# Altium schematic sheet FootBoard.SchDoc
size B; SheetNumber: 1; SheetTotal: 1
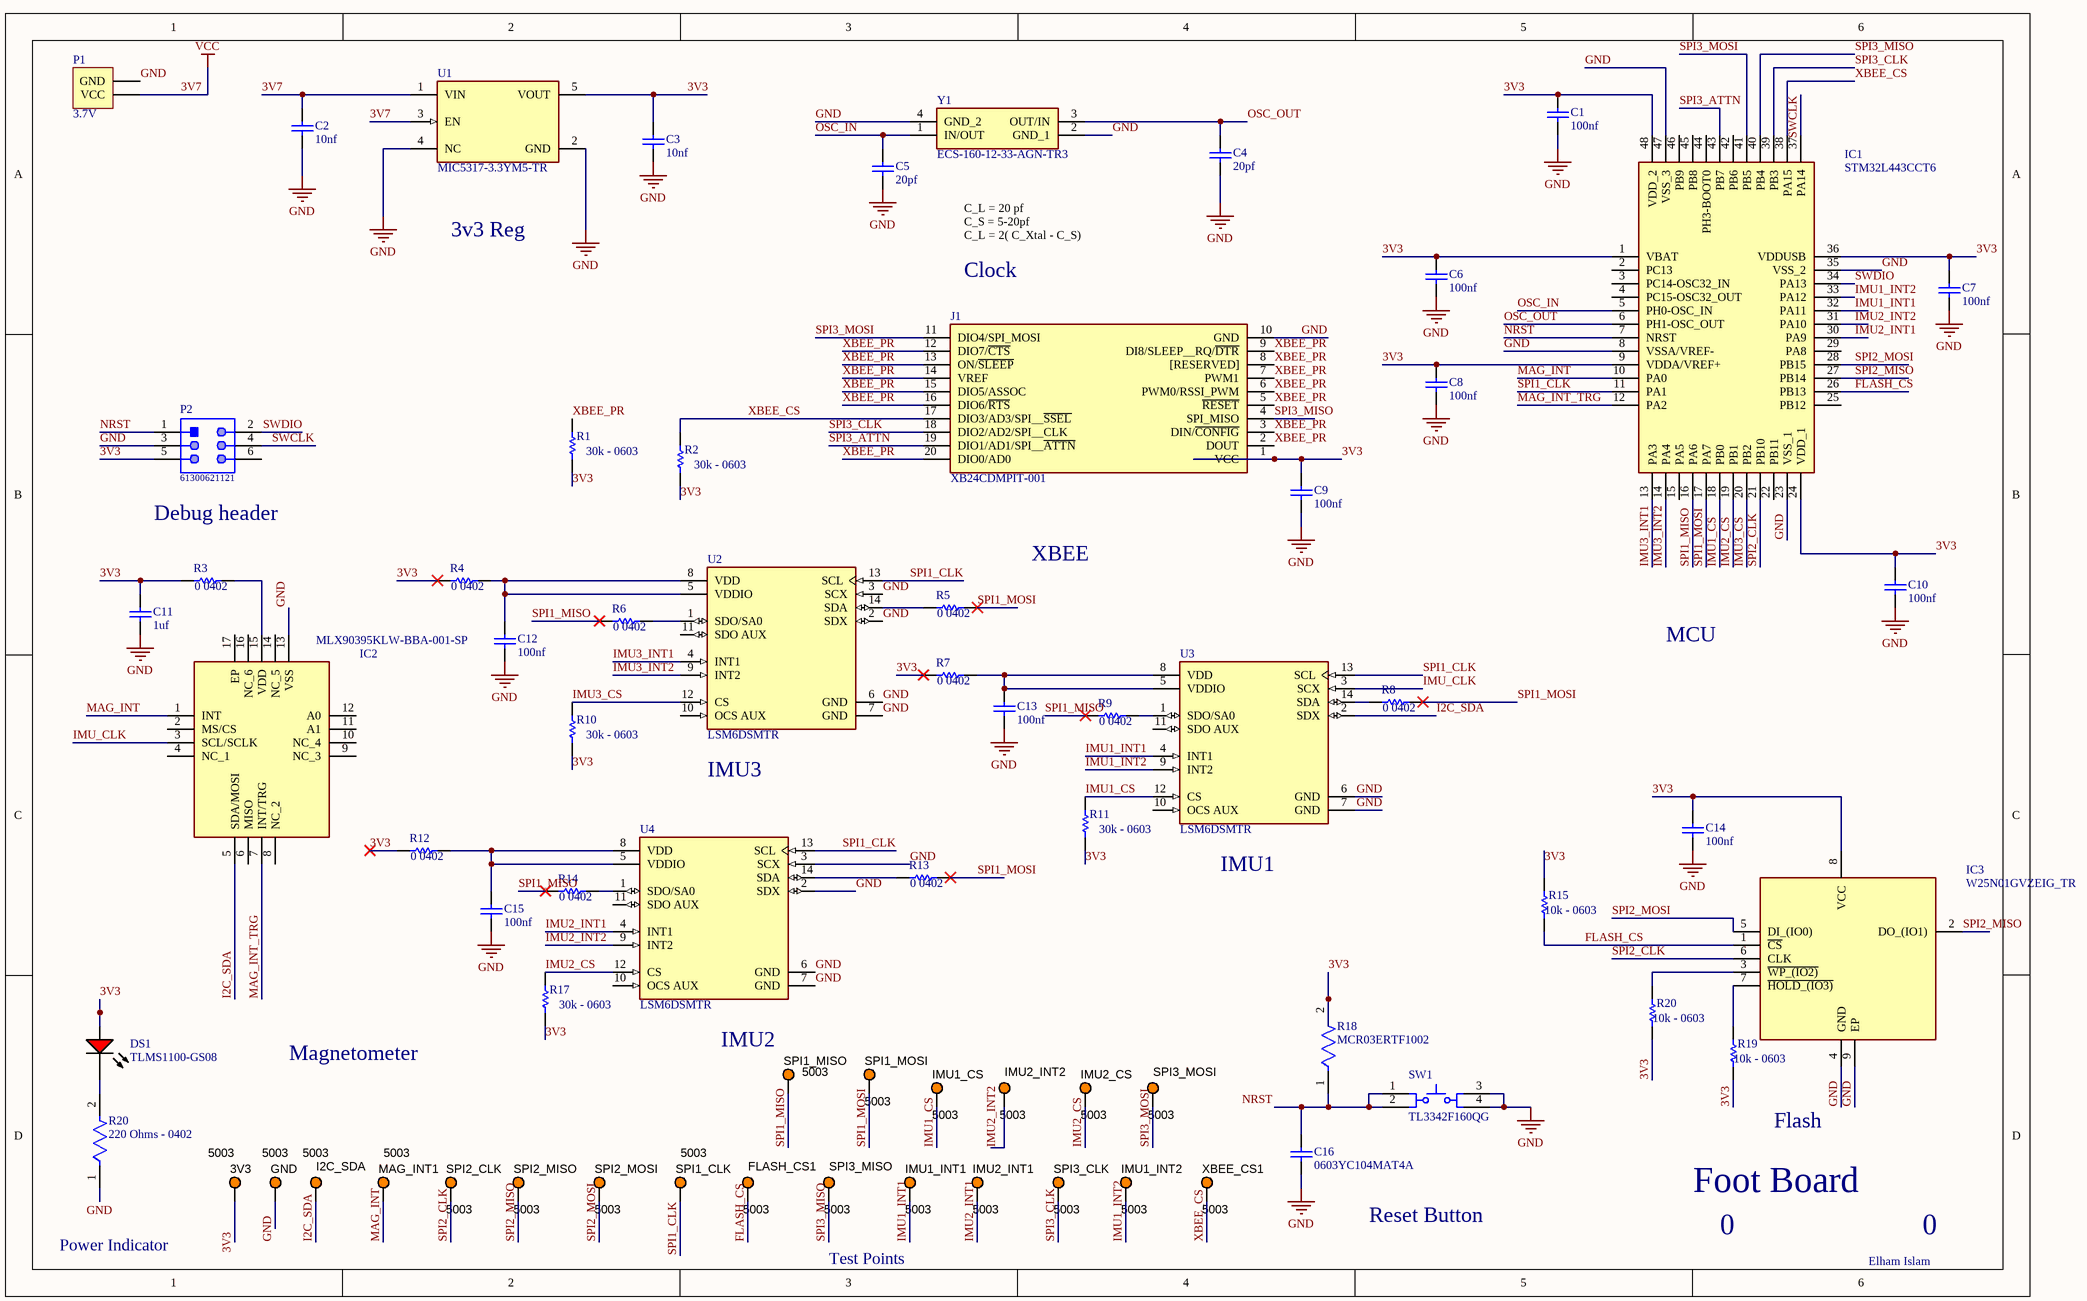
[diagram p0: FootBoard.SchDoc]

## Parts
(Parts that share a designator on the sheet are numbered #1, #2 ... from top to bottom, then left to right.)
3V3  5003  [KSTN-5003]
C1  100nf  [CAPC1608X90X35ML15T15]
C2  10nf  [CAPC1608X90X35ML15T15]
C3  10nf  [CAPC1608X90X35ML15T15]
C4  20pf  [CAPC2013X140X50NL20T25]
C5  20pf  [CAPC2013X140X50NL20T25]
C6  100nf  [CAPC1608X90X35ML15T15]
C7  100nf  [CAPC1608X90X35ML15T15]
C8  100nf  [CAPC1608X90X35ML15T15]
C9  100nf  [CAPC1608X90X35ML15T15]
C10  100nf  [CAPC1608X90X35ML15T15]
C11  1uf  [CAPC1608X90X35ML15T15]
C12  100nf  [CAPC1608X90X35ML15T15]
C13  100nf  [CAPC1608X90X35ML15T15]
C14  100nf  [CAPC1608X90X35ML15T15]
C15  100nf  [CAPC1608X90X35ML15T15]
C16  0603YC104MAT4A  [CAPC1608X90X35LL15T15]
DS1  TLMS1100-GS08  [VISH-TLMX1100_V]
FLASH_CS1  5003  [KSTN-5003]
GND  5003  [KSTN-5003]
I2C_SDA  5003  [KSTN-5003]
IC1  STM32L443CCT6  [QFP50P900X900X160-48N]
IC2  MLX90395KLW-BBA-001-SP  [QFN50P300X300X100-17N-D]
IC3  W25N01GVZEIG_TR  [SON127P800X600X80-9N-D]
IMU1_CS  5003  [KSTN-5003]
IMU1_INT1  5003  [KSTN-5003]
IMU1_INT2  5003  [KSTN-5003]
IMU2_CS  5003  [KSTN-5003]
IMU2_INT1  5003  [KSTN-5003]
IMU2_INT2  5003  [KSTN-5003]
J1  XB24CDMPIT-001  [XB24CDMPIT001]
MAG_INT1  5003  [KSTN-5003]
P1  3.7V  [HDR1X2]
P2  61300621121  [61300621121]
R1  30k - 0603  [RESC1609X55X30LL15T15]
R2  30k - 0603  [RESC1609X55X30LL15T15]
R3  0 0402  [RESC1005X40X25NL05T10]
R4  0 0402  [RESC1005X40X25NL05T10]
R5  0 0402  [RESC1005X40X25NL05T10]
R6  0 0402  [RESC1005X40X25NL05T10]
R7  0 0402  [RESC1005X40X25NL05T10]
R8  0 0402  [RESC1005X40X25NL05T10]
R9  0 0402  [RESC1005X40X25NL05T10]
R10  30k - 0603  [RESC1609X55X30LL15T15]
R11  30k - 0603  [RESC1609X55X30LL15T15]
R12  0 0402  [RESC1005X40X25NL05T10]
R13  0 0402  [RESC1005X40X25NL05T10]
R14  0 0402  [RESC1005X40X25NL05T10]
R15  10k - 0603  [RESC1609X55X30LL15T15]
R17  30k - 0603  [RESC1609X55X30LL15T15]
R18  MCR03ERTF1002  [FP-MCR03-IPC_C]
R19  10k - 0603  [RESC1609X55X30LL15T15]
R20#1  10k - 0603  [RESC1609X55X30LL15T15]
R20#2  220 Ohms - 0402  [FP-PNM0402-MFG]
SPI1_CLK  5003  [KSTN-5003]
SPI1_MISO  5003  [KSTN-5003]
SPI1_MOSI  5003  [KSTN-5003]
SPI2_CLK  5003  [KSTN-5003]
SPI2_MISO  5003  [KSTN-5003]
SPI2_MOSI  5003  [KSTN-5003]
SPI3_CLK  5003  [KSTN-5003]
SPI3_MISO  5003  [KSTN-5003]
SPI3_MOSI  5003  [KSTN-5003]
SW1  TL3342F160QG  [ESWI-TL3342F160QG_V]
U1  MIC5317-3.3YM5-TR  [FP-SOT23-5LD-PL-1-MFG]
U2  LSM6DSMTR  [FP-LGA-14L-DM00249496-MFG]
U3  LSM6DSMTR  [FP-LGA-14L-DM00249496-MFG]
U4  LSM6DSMTR  [FP-LGA-14L-DM00249496-MFG]
XBEE_CS1  5003  [KSTN-5003]
Y1  ECS-160-12-33-AGN-TR3  [ECS1601233AGNTR3]

## Nets
3V7: C2.2 P1.1(VCC) U1.1(VIN) U1.3(EN)  [also labelled VCC]
GND: C1.1 C2.1 C3.1 C4.1 C5.1 C6.1 C7.1 C8.1 C9.1 C10.1 C11.1 C12.1 C13.1 C14.1 C15.1 C16.1 GND.1 IC1.8(VSSA/VREF-) IC1.23(VSS_1) IC1.35(VSS_2) IC1.47(VSS_3) IC2.13(VSS) IC3.4(GND) IC3.9(EP) J1.10(GND) P1.2(GND) P2.3 R20#2.1 SW1.3 SW1.4 U1.2(GND) U1.4(NC) U2.2(SDX) U2.3(SCX) U2.6(GND) U2.7(GND) U3.6(GND) U3.7(GND) U4.2(SDX) U4.3(SCX) U4.6(GND) U4.7(GND) Y1.2(GND_1) Y1.4(GND_2)
3V3: 3V3.1 C1.2 C3.2 C6.2 C7.2 C8.2 C9.2 C10.2 C11.2 C14.2 DS1.1(A) IC1.1(VBAT) IC1.9(VDDA/VREF+) IC1.24(VDD_1) IC1.36(VDDUSB) IC1.48(VDD_2) IC3.8(VCC) J1.1(VCC) P2.5 R1.1 R2.1 R3.1 R4.1 R7.1 R10.1 R11.1 R12.1 R15.2 R17.1 R18.2 R19.1 R20#1.1 U1.5(VOUT)
FLASH_CS: FLASH_CS1.1 IC1.26(PB13) IC3.1(~{CS}) R15.1
I2C_SDA: I2C_SDA.1 IC2.5(SDA/MOSI) U3.2(SDX)
IMU1_CS: IC1.18(PB0) IMU1_CS.1 R11.2 U3.12(CS)
IMU1_INT1: IC1.32(PA11) IMU1_INT1.1 U3.4(INT1)
IMU1_INT2: IC1.33(PA12) IMU1_INT2.1 U3.9(INT2)
IMU2_CS: IC1.19(PB1) IMU2_CS.1 R17.2 U4.12(CS)
IMU2_INT1: IC1.30(PA9) IMU2_INT1.1 U4.4(INT1)
IMU2_INT2: IC1.31(PA10) IMU2_INT2.1 U4.9(INT2)
IMU3_CS: IC1.20(PB2) R10.2 U2.12(CS)
IMU3_INT1: IC1.13(PA3) U2.4(INT1)
IMU3_INT2: IC1.14(PA4) U2.9(INT2)
IMU_CLK: IC2.3(SCL/SCLK) U3.3(SCX)
MAG_INT: IC1.10(PA0) IC2.1(INT) MAG_INT1.1
MAG_INT_TRG: IC1.12(PA2) IC2.7(INT/TRG)
NRST: C16.2 IC1.7(NRST) P2.1 R18.1 SW1.1 SW1.2
OSC_IN: C5.2 IC1.5(PH0-OSC_IN) Y1.1(IN/OUT)
OSC_OUT: C4.2 IC1.6(PH1-OSC_OUT) Y1.3(OUT/IN)
SPI1_CLK: IC1.11(PA1) SPI1_CLK.1 U2.13(SCL) U3.13(SCL) U4.13(SCL)
SPI1_MISO: IC1.16(PA6) R6.1 R9.1 R14.1 SPI1_MISO.1
SPI1_MOSI: IC1.17(PA7) R5.2 R8.2 R13.2 SPI1_MOSI.1
SPI2_CLK: IC1.21(PB10) IC3.6(CLK) SPI2_CLK.1
SPI2_MISO: IC1.27(PB14) IC3.2(DO_(IO1)) SPI2_MISO.1
SPI2_MOSI: IC1.28(PB15) IC3.5(DI_(IO0)) SPI2_MOSI.1
SPI3_ATTN: IC1.43(PB7) J1.19(DIO1/AD1/SPI__~{ATTN})
SPI3_CLK: IC1.39(PB3) J1.18(DIO2/AD2/SPI__CLK) SPI3_CLK.1
SPI3_MISO: IC1.40(PB4) J1.4(SPI_MISO) SPI3_MISO.1
SPI3_MOSI: IC1.41(PB5) J1.11(DIO4/SPI_MOSI) SPI3_MOSI.1
SWCLK: IC1.37(PA14) P2.4
SWDIO: IC1.34(PA13) P2.2
XBEE_CS: IC1.38(PA15) J1.17(DIO3/AD3/SPI__~{SSEL}) R2.2 XBEE_CS1.1
XBEE_PR: J1.2(DOUT) J1.3(DIN/~{CONFIG}) J1.5(~{RESET}) J1.6(PWM0/RSSI_PWM) J1.7(PWM1) J1.8([RESERVED]) J1.9(DI8/SLEEP__RQ/~{DTR}) J1.12(DIO7/~{CTS}) J1.13(ON/~{SLEEP}) J1.14(VREF) J1.15(DIO5/ASSOC) J1.16(DIO6/~{RTS}) J1.20(DIO0/AD0) R1.2
NetC12_2: C12.2 R4.2 U2.5(VDDIO) U2.8(VDD)
NetC13_2: C13.2 R7.2 U3.5(VDDIO) U3.8(VDD)
NetC15_2: C15.2 R12.2 U4.5(VDDIO) U4.8(VDD)
NetDS1_2: DS1.2(K) R20#2.2
NetIC2_15: IC2.15(VDD) R3.2
NetIC3_3: IC3.3(~{WP_(IO2)}) R20#1.2
NetIC3_7: IC3.7(~{HOLD_(IO3)}) R19.2
NetR5_1: R5.1 U2.14(SDA)
NetR6_2: R6.2 U2.1(SDO/SA0)
NetR8_1: R8.1 U3.14(SDA)
NetR9_2: R9.2 U3.1(SDO/SA0)
NetR13_1: R13.1 U4.14(SDA)
NetR14_2: R14.2 U4.1(SDO/SA0)

Not connected (* = marked no-connect by the designer): IC1 2(PC13) 3(PC14-OSC32_IN) 4(PC15-OSC32_OUT) 15(PA5) 22(PB11) 25(PB12) 29(PA8) 42(PB6) 44(PH3-BOOT0) 45(PB8) 46(PB9); IC2 2(MS/CS) 4(NC_1) 6(MISO) 8(NC_2) 9(NC_3) 10(NC_4) 11(A1) 12(A0) 14(NC_5) 16(NC_6) 17(EP); P2 6; U2 10(OCS_AUX) 11(SDO_AUX); U3 10(OCS_AUX) 11(SDO_AUX); U4 10(OCS_AUX) 11(SDO_AUX)

## Notes on the sheet
- 3v3 Reg
- C_L = 20 pf
  C_S = 5-20pf
  C_L = 2( C_Xtal - C_S)
- Clock
- Debug header
- XBEE
- (near U2) Type @ to refer to a designator or a net
- MCU
- IMU3
- (near U4) Type @ to refer to a designator or a net
- (near U3) IMU1
- IMU2
- Magnetometer
- Flash
- Power Indicator
- Reset Button
- Foot Board
- 0
- Test Points
- Elham Islam

## Library data of the parts
3V3 FLASH_CS1 GND I2C_SDA IMU1_CS IMU1_INT1 IMU1_INT2 IMU2_CS IMU2_INT1 IMU2_INT2 MAG_INT1 SPI1_CLK SPI1_MISO SPI1_MOSI SPI2_CLK SPI2_MISO SPI2_MOSI SPI3_CLK SPI3_MISO SPI3_MOSI XBEE_CS1 = CMP-1672-00009-1: Test Point, Orange, 1-Pin THD, RoHS; Peak Reverse Current: 600 uA; Forward Current: 3 A; Max Surge Current: 80 A; Forward Voltage: 1.08 V; Max Operating Temperature: 150 degC; PackageReference: 5003; Pins: 2; ComponentLink2URL: http://keyelco.com/userAssets/file/M65p56.pdf; PackageDescription: 1-Pin Through Hole Device, Dia 2.54 mm; Weight: 0.01 lb; Diameter: 5.3 mm; Mount: Through Hole; Package Quantity: 500; Packaging: Bulk; Min Operating Temperature: -65 degC; ComponentLink1Description: Manufacturer URL; Height: 0.25 inch; ComponentLink1URL: http://www.keyelco.com/; ComponentLink2Description: Datasheet; Width: 0.25 inch; REACH SVHC: No SVHC; RoHSCompliant: true; Radiation Hardening: No; Length: 9.5 mm; DatasheetVersion: Jun-15
C1-C3 C6-C15 = CMP-2006-04543-1: Part Number: 0603YG105ZAT4A; Manufacturer: AVX Interconnect / Elco
C4 C5 = CMP-2007-04537-1: Part Number: 08051A200JAT2A; Manufacturer: AVX Interconnect / Elco
C16 = CMP-2006-02126-1: Manufacturer: AVX Interconnect / Elco; Part Number: 0603YC104MAT4A
DS1 = CMP-1666-00027-1: LED, RED, 2.1 V, -40 to 100 degC, 2-Pin SMD (0603), RoHS, Tape and Reel; Type (Capacitors): C0G; Resistance: 100000000000 Ohm; Capacitance: 12 pF; Voltage Rating: 50 V; Tolerance: 5%; Min Operating Temperature: -55degC; REACH SVHC: No SVHC; ComponentLink2Description: Datasheet; ComponentLink1URL: http://www.vishay.com/; Width: 0.8 mm; Package Quantity: 4000; PackageReference: TLMX1100; ComponentLink2URL: http://www.vishay.com/docs/83173/tlmb1100.pdf; Case/Package: 0603; Case Code (Metric): 1608; Packaging: Tape and Reel; Pins: 2; ComponentLink1Description: Manufacturer URL; Max Operating Temperature: 125degC; Height: 0.8 mm; Length: 1.6 mm; Mount: Surface Mount; PackageDescription: 2-Pin Surface Mount Device, Body 1.6 x 0.8 mm; DatasheetVersion: Rev. 2.7, 03/2016; Case Code (Imperial): 0603; Voltage Rating (DC): 50 V; RoHSCompliant: True; Radiation Hardening: No
IC1 = STM32L443CCT6: Integrated Circuit; Manufacturer_Name: STMicroelectronics; Datasheet Link: https://componentsearchengine.com/Datasheets/2/STM32L443CCT6.pdf; Height: 1.6mm; Manufacturer_Part_Number: STM32L443CCT6; Mouser Part Number: 511-STM32L443CCT6; Mouser Price/Stock: https://www.mouser.co.uk/ProductDetail/STMicroelectronics/STM32L443CCT6?qs=dTJS0cRn7ohLPtZ3IeJ%2Fbg%3D%3D; Arrow Part Number: STM32L443CCT6; Arrow Price/Stock: https://www.arrow.com/en/products/stm32l443cct6/stmicroelectronics?region=nac
IC2 = MLX90395KLW-BBA-001-SP: Integrated Circuit; Manufacturer_Name: Melexis; Datasheet Link: https://www.mouser.de/datasheet/2/734/Melexis_MLX90395_Datasheet_Melexis3-1863596.pdf; Height: 1mm; Manufacturer_Part_Number: MLX90395KLW-BBA-001-SP; Mouser Part Number: 482-90395KLWBBA001SP; Mouser Price/Stock: https://www.mouser.co.uk/ProductDetail/Melexis/MLX90395KLW-BBA-001-SP?qs=7MVldsJ5Uawn%252BTu7jMWOxA%3D%3D
IC3 = W25N01GVZEIG_TR: Integrated Circuit; Manufacturer_Name: Winbond; Manufacturer_Part_Number: W25N01GVZEIG TR; Datasheet Link: https://www.winbond.com/resource-files/w25n01gv revg 032116.pdf; Height: 0.8mm; Mouser Part Number: 454-W25N01GVZEIGTR; Mouser Price/Stock: https://www.mouser.co.uk/ProductDetail/Winbond/W25N01GVZEIG-TR?qs=qSfuJ%252Bfl%2Fd6niBi0Qz1MPg%3D%3D; Arrow Part Number: W25N01GVZEIG TR; Arrow Price/Stock: https://www.arrow.com/en/products/w25n01gvzeigtr/winbond-electronics?region=nac
J1 = XB24CDMPIT-001: Connector; Manufacturer_Name: DIGI; Datasheet Link: https://www.digi.com/pdf/ds_s2c-xbeedigimesh-24.pdf; Height: 3.556mm; Manufacturer_Part_Number: XB24CDMPIT-001; Mouser Part Number: 888-XB24CDMPIT-001; Mouser Price/Stock: https://www.mouser.co.uk/ProductDetail/DIGI/XB24CDMPIT-001?qs=XmMZR4xR0DA19znDagFynA%3D%3D
P1 = Header 2: Header, 2-Pin; LatestRevisionDate: 17-Jul-2002; LatestRevisionNote: Re-released for DXP Platform.; Publisher: Altium Limited
P2 = CMP-1502-01072-1: THT Vertical Pin Header WR-PHD, Pitch 2.54 mm, Dual Row, 6 pins; Manufacturer: Wurth Elektronik; Contact Resistance: 20mOhm; Withstanding Voltage: 500VAC; Pin Number: 6; Gender: Male; Pitch: 2.54mm; Working Voltage: 250VAC; Rated Current: 3A; Packaging: Bag; Row Number: Dual; Manufacturer URL: http://www.we-online.de; Part Number: 61300621121; Operating Temperature: -40to105degC; Mounting Technology: THT; Package Reference: 61300621121; Datasheet URL: https://katalog.we-online.de/em/datasheet/6130xx21121.pdf; Orientation: Vertical; Publisher: WurthElektronik
R1 R2 R10 R11 R15 R17 R19 R20#1 = CMP-1012-00623-3: Chip Resistor, 10 KOhm, +/- 1%, 0.1 W, -55 to 155 degC, 0603 (1608 Metric), RoHS, Tape and Reel; Manufacturer: Panasonic; Voltage Rating: 75V; Case\/Package: 0603; Power Rating: 100mW; Resistance: 10KOhm; Temperature Coefficient: 100ppm\/degreesC; Number of Pins: 2; Package Reference: 603; Depth: 0.8mm; Mount: SurfaceMount; Package Description: 2-Pin Surface Mount Device, Body 1.6 x 0.85 mm; Datasheet Version: 02/2017; Length: 1.6mm; Lead Free: LeadFree; Height: 0.45mm; Number of Terminations: 2; Max Power Dissipation: 100mW; Min Operating Temperature: -55degC; Datasheet URL: https://industrial.panasonic.com/cdbs/www-data/pdf/RDA0000/AOA0000C304.pdf; Termination: SMD/SMT; Case Code (Metric): 1608; Case Code (Imperial): 0603; Tolerance: 1%; Max Operating Temperature: 155degC; RoHSCompliant: true; Voltage Rating (DC): 75V; Radiation Hardening: No; Packaging: TapeandReel; Composition: ThickFilm; Mounting Technology: SurfaceMount; Manufacturer URL: http://www.panasonic.com/; Width: 0.031inch; REACH SVHC: NoSVHC; Contact Plating: Tin; Military Standard: Not; Package Quantity: 1
R3-R9 R12-R14 = CMP-1011-00001-2: Manufacturer: Yageo / Phycomp; Part Number: RC0402JR-070RL
R18 = CMP-2000-06685-2: Thick Film Chip Resistor, 0603, 10kΩ, 1%, 100ppm/°C, 0.1W, 50V; Max Power Dissipation: 100mW; Resistance: 10kR; Case Code (Imperial): 0603; RoHS Compliant: Yes; Voltage Rating (DC): 50V; Series: MCR; Case Code (Metric): 1608; Temperature Coefficient: 100ppm/°C; Package Quantity: 1; Packaging: Tape and Reel; Lead Free: Lead Free; Min Operating Temperature: -55°C; Max Operating Temperature: 155°C; Height: 0.022inch; Length: 0.063inch; Width: 0.031inch; Tolerance: 1%; Case/Package: 0603; Resistor Type: Thick Film; Number of Terminations: 2
R20#2 = CMP-02407-011888-1: RES SMD 500 OHM 0.1% 1/20W 0402; Temperature Coefficient: 25ppm/°C; Max Power Dissipation: 50mW; Resistance: 500R; Width: 0.022inch; Length: 0.042inch; Tolerance: 0.1%; Lead Free: Lead Free; Height: 0.033inch; Case Code (Metric): 1005; Features: Moisture Resistant; Case Code (Imperial): 0402; Max Operating Temperature: 155°C; Case/Package: 0402; Min Operating Temperature: -55°C; Package Quantity: 1000; RoHS Compliant: Yes; Packaging: Tape and Reel; Resistor Type: Thin Film; Number of Terminations: 2
SW1 = CMP-1696-00003-1: Switch, Tactile, SPST-NO, 50 mA, 12 V, 4-Pin SMD, RoHS, Tape and Reel; Voltage Rating (DC): 50 V; Tolerance: 20%; Case\Package: Radial; Capacitance: 4.7 uF; Max Operating Temperature: 85 degC; REACH SVHC: No SVHC; Package Quantity: 200; Voltage Rating: 50 V; ComponentLink1Description: Manufacturer URL; ComponentLink2URL: http://spec_sheets.e-switch.com/specs/P010632.pdf; ComponentLink2Description: Datasheet; Height: 11 mm; Lead Pitch: 2 mm; RoHSCompliant: true; Radiation Hardening: No; Pins: 2; Length: 11 mm; DatasheetVersion: Rev. I, 12/2010; PackageReference: TL3342F160QG; ComponentLink1URL: http://www.e-switch.ch/en/; PackageDescription: 4-Pin Surface Mount Device, Body 5 x 5 mm, Pitch 6.3 mm; Mount: Through Hole; Diameter: 5 mm; Packaging: Bulk; Min Operating Temperature: -40 degC; Width: 0 inch
U1 = CMP-06324-000116-1: IC REG LINEAR 3.3V 150MA SOT23-5; Max Input Voltage: 6V; Number of Regulators: 1; Min Current Limit: 200mA; Dropout Voltage: 155mV; Min Input Voltage: 2.5V; Power Supply Rejection Ratio (PSRR): 70dB; Case/Package: SOT-23-5; Output Voltage: 3.3V; Series: -; Max Operating Temperature: 125°C; Package Quantity: 3000; Mount: Surface Mount; Packaging: Tape and Reel; RoHS Compliant: No; Output Current: 150mA; Min Operating Temperature: -40°C; Number of Outputs: 1
U2-U4 = CMP-12177-000008-1: IMU ACCEL/GYRO I2C/SPI 14LGA; Manufacturer: STMicroelectronics; Operating Supply Current: 0.29-0.65mA; Gyro Range: 125/250/500/1000/2000°/s; Sensor Output: I2C,SPI; Accel Range: 2/4/8/16g; Min Supply Voltage: 1.62V; Resolution: 16bits; Sensor Type: Temperature,Accelerometer,Gyroscope; Max Supply Voltage: 3.6V; Manufacturer Part Number: LSM6DSMTR; Octopart: https://octopart.com/lsm6dsmtr-stmicroelectronics-66358194; Height: 0.86mm; Category: IC; Lead Free: Yes; Temperature: -40°C to +85°C; Temperature Range Low: -40°C; ComponentLink2Description: Datasheet; ComponentLink2URL: https://www.st.com/resource/en/datasheet/lsm6dsm.pdf; Digikey Description: IMU ACCEL/GYRO I2C/SPI 14LGA; Footprint Url: https://www.st.com/content/ccc/resource/technical/document/technical_note/73/17/9c/16/dd/96/4a/01/CD00134799.pdf/files/CD00134799.pdf/jcr:content/translations/en.CD00134799.pdf; Device Class L1: Sensors; Device Class L2: Motion Sensors; Temperature Range High: +85°C; Mouser Description: LSM6DSM Series 3.6 V I2C/SPI 3D Accelerometer and 3D Gyroscope - LGA-14; Device Class L3: Inertial Measurement Units (IMUs); Automotive: No; Package: LGA-14L-DM00249496; RoHS: TRUE
Y1 = ECS-160-12-33-AGN-TR3: Crystal or Oscillator; Manufacturer_Name: ECS; Datasheet Link: https://ecsxtal.com/store/pdf/ecx-32.pdf; Height: 0.8mm; Manufacturer_Part_Number: ECS-160-12-33-AGN-TR3; Mouser Part Number: 520-160-12-33AGN-TR3; Mouser Price/Stock: https://www.mouser.co.uk/ProductDetail/ECS/ECS-160-12-33-AGN-TR3?qs=e8oIoAS2J1R5dXUdgVaN0g%3D%3D; Arrow Part Number: ECS-160-12-33-AGN-TR3; Arrow Price/Stock: https://www.arrow.com/en/products/ecs-160-12-33-agn-tr3/ecs-international?region=nac